# EAGLE design science pcb_urc_v1 (EAGLE 9.6.2)
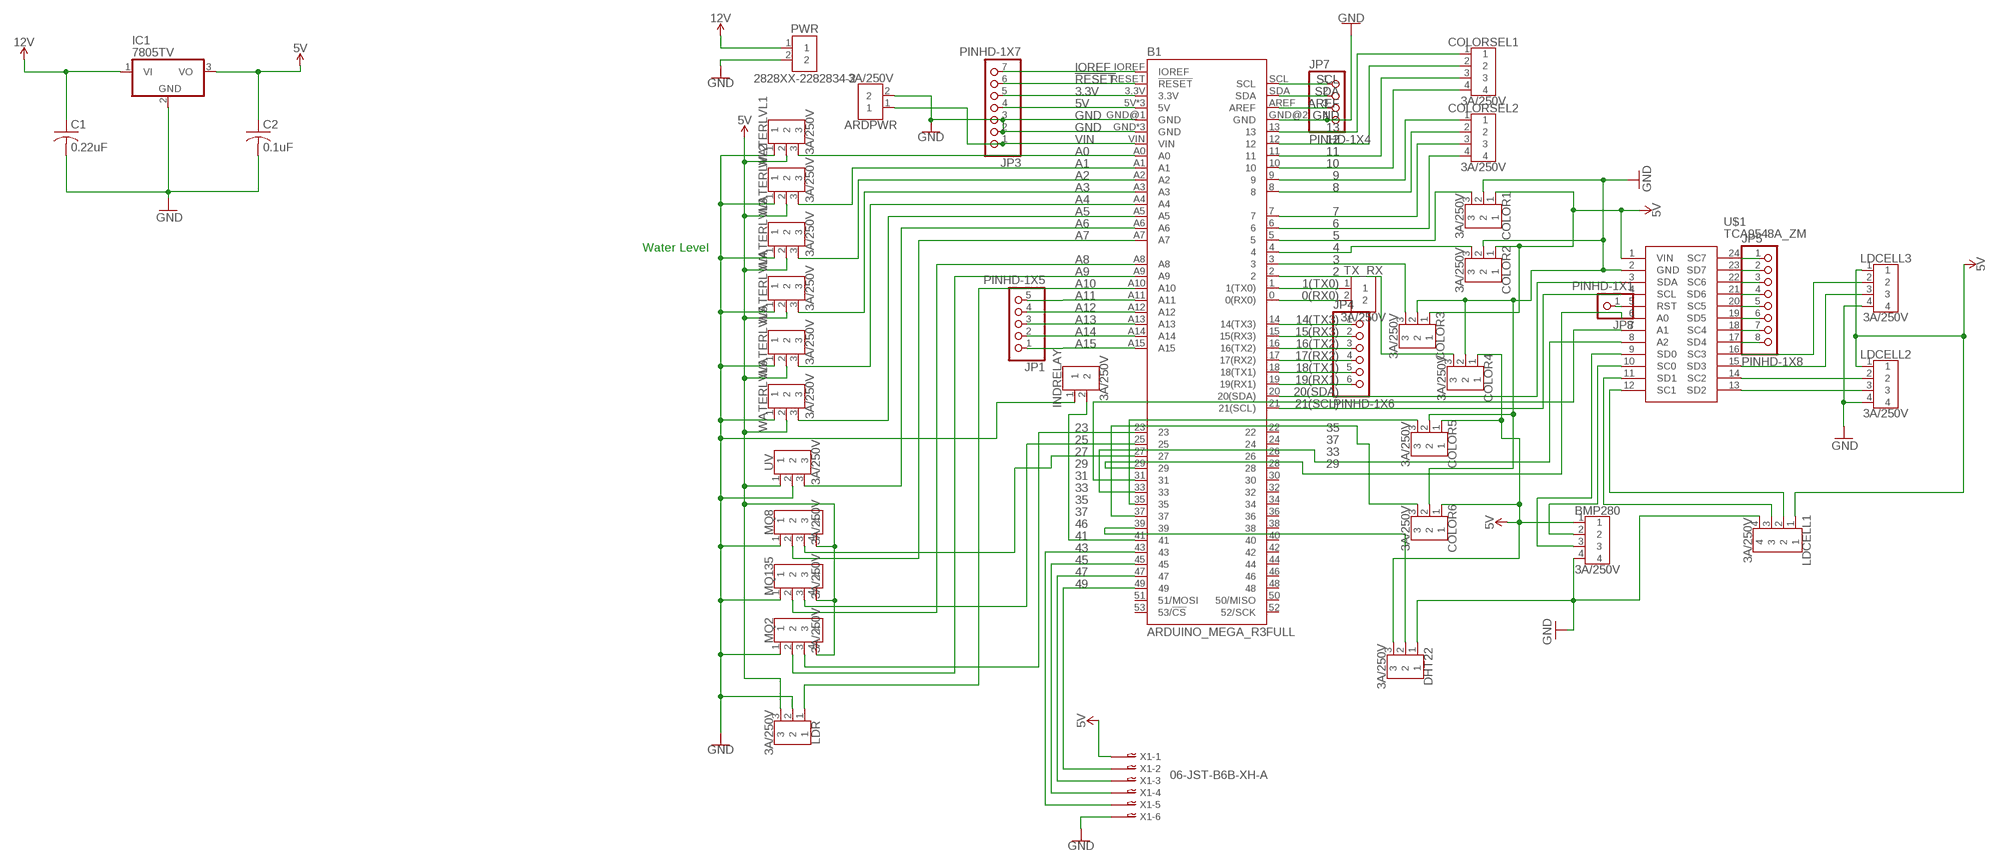
[diagram p0: schematic, sheet 1]

## Parts
ARDPWR  3A/250V  B2B-XH-A  [B2B-XH-A]
B1  ARDUINO_MEGA_R3FULL  [ARDUINO_MEGA_NO_SILK]
BMP280  3A/250V  B4B-XH-A  [B4B-XH-A]
C1  0.22uF  C-US025-025X050  [C025-025X050]
C2  0.1uF  C-US025-025X050  [C025-025X050]
COLOR1  3A/250V  B3B-XH-A  [B3B-XH-A]
COLOR2  3A/250V  B3B-XH-A  [B3B-XH-A]
COLOR3  3A/250V  B3B-XH-A  [B3B-XH-A]
COLOR4  3A/250V  B3B-XH-A  [B3B-XH-A]
COLOR5  3A/250V  B3B-XH-A  [B3B-XH-A]
COLOR6  3A/250V  B3B-XH-A  [B3B-XH-A]
COLORSEL1  3A/250V  B4B-XH-A  [B4B-XH-A]
COLORSEL2  3A/250V  B4B-XH-A  [B4B-XH-A]
DHT22  3A/250V  B3B-XH-A  [B3B-XH-A]
IC1  7805TV  [TO220V]
INDRELAY  3A/250V  B2B-XH-A  [B2B-XH-A]
JP1  PINHD-1X5  [1X05]
JP3  PINHD-1X7  [1X07]
JP4  PINHD-1X6  [1X06]
JP5  PINHD-1X8  [1X08]
JP7  PINHD-1X4  [1X04]
JP8  PINHD-1X1  [1X01]
LDCELL1  3A/250V  B4B-XH-A  [B4B-XH-A]
LDCELL2  3A/250V  B4B-XH-A  [B4B-XH-A]
LDCELL3  3A/250V  B4B-XH-A  [B4B-XH-A]
LDR  3A/250V  B3B-XH-A  [B3B-XH-A]
MQ2  3A/250V  B4B-XH-A  [B4B-XH-A]
MQ8  3A/250V  B4B-XH-A  [B4B-XH-A]
MQ135  3A/250V  B4B-XH-A  [B4B-XH-A]
PWR  2828XX-2282834-2  [TERMBLK_254-2N]
TX_RX  3A/250V  B2B-XH-A  [B2B-XH-A]
U$1  TCA9548A_ZM  [2717]
UV  3A/250V  B3B-XH-A  [B3B-XH-A]
WATERLVL1  3A/250V  B3B-XH-A  [B3B-XH-A]
WATERLVL2  3A/250V  B3B-XH-A  [B3B-XH-A]
WATERLVL3  3A/250V  B3B-XH-A  [B3B-XH-A]
WATERLVL4  3A/250V  B3B-XH-A  [B3B-XH-A]
WATERLVL5  3A/250V  B3B-XH-A  [B3B-XH-A]
WATERLVL6  3A/250V  B3B-XH-A  [B3B-XH-A]
X1  06-JST-B6B-XH-A  [B6B-XH]

## Nets
0(RX0): B1.0(0(RX0)) TX_RX.2
1(TX0): B1.1(1(TX0)) TX_RX.1
2: B1.2 COLOR4.3
3: B1.3 COLOR3.3
3.3V: B1.3.3V JP3.5
4: B1.4 COLOR2.3
5: B1.5 COLOR1.3
5V [PWR]: B1.5V B1.5V@1(5V) B1.5V@2(5V) BMP280.1 C2.1 COLOR1.1 COLOR2.1 COLOR3.1 COLOR4.1 COLOR5.1 COLOR6.1 DHT22.3 IC1.3(VO) JP3.4 LDCELL1.1 LDCELL2.1 LDCELL3.1 LDR.3 MQ2.4 MQ8.4 MQ135.4 U$1.1(VIN) UV.1 WATERLVL1.2 WATERLVL2.2 WATERLVL3.2 WATERLVL4.2 WATERLVL5.2 WATERLVL6.2 X1.P$1
6: B1.6 COLORSEL2.4
7: B1.7 COLORSEL2.3
8: B1.8 COLORSEL2.2
9: B1.9 COLORSEL2.1
10: B1.10 COLORSEL1.4
11: B1.11 COLORSEL1.3
12: B1.12 COLORSEL1.2
12V [PWR]: C1.1 IC1.1(VI) PWR.1
13: B1.13 COLORSEL1.1
14(TX3): B1.14(14(TX3)) JP4.1
15(RX3): B1.15(15(RX3)) JP4.2
16(TX2): B1.16(16(TX2)) JP4.3
17(RX2): B1.17(17(RX2)) JP4.4
18(TX1): B1.18(18(TX1)) JP4.5
19(RX1): B1.19(19(RX1)) JP4.6
20(SDA): B1.20(20(SDA)) U$1.3(SDA)
21(SCL): B1.21(21(SCL)) U$1.4(SCL)
23: B1.27 MQ8.3
25: B1.25 MQ135.3
27: B1.23 MQ2.3
29: B1.29 U$1.6(A0)
31: B1.31 U$1.7(A1)
33: B1.33 U$1.8(A2)
35: B1.35 COLOR5.3
37: B1.37 COLOR6.3
41: B1.41 INDRELAY.2
43: B1.43 X1.P$5
45: B1.45 X1.P$4
46: B1.39 DHT22.2
47: B1.47 X1.P$3
49: B1.49 X1.P$2
!RESET: B1.RESET(!RESET) JP3.6
A0: B1.A0 WATERLVL1.3
A1: B1.A1 WATERLVL2.3
A2: B1.A2 WATERLVL3.3
A3: B1.A3 WATERLVL4.3
A4: B1.A4 WATERLVL5.3
A5: B1.A5 WATERLVL6.3
A6: B1.A6 UV.3
A7: B1.A7 MQ8.2
A8: B1.A8 MQ135.2
A9: B1.A9 MQ2.2
A10: B1.A10 LDR.1
A11: B1.A11 JP1.5
A12: B1.A12 JP1.4
A13: B1.A13 JP1.3
A14: B1.A14 JP1.2
A15: B1.A15 JP1.1
AREF: B1.AREF JP7.3
GND [PWR]: ARDPWR.2 B1.GND B1.GND@1(GND) B1.GND@2(GND) B1.GND@3(GND) B1.GND@4(GND) BMP280.4 C1.2 C2.2 COLOR1.2 COLOR2.2 COLOR3.2 COLOR4.2 COLOR5.2 COLOR6.2 DHT22.1 IC1.2(GND) INDRELAY.1 JP3.2 JP3.3 JP7.4 LDCELL1.4 LDCELL2.4 LDCELL3.4 LDR.2 MQ2.1 MQ8.1 MQ135.1 PWR.2 U$1.2(GND) UV.2 WATERLVL1.1 WATERLVL2.1 WATERLVL3.1 WATERLVL4.1 WATERLVL5.1 WATERLVL6.1 X1.P$6
IOREF: B1.IOREF JP3.7
N$1: LDCELL1.3 U$1.11(SD1)
N$2: LDCELL1.2 U$1.12(SC1)
N$3: LDCELL2.3 U$1.13(SD2)
N$4: LDCELL2.2 U$1.14(SC2)
N$5: LDCELL3.3 U$1.15(SD3)
N$6: LDCELL3.2 U$1.16(SC3)
N$9: JP8.1 U$1.5(RST)
N$10: JP5.1 U$1.24(SC7)
N$11: JP5.2 U$1.23(SD7)
N$12: JP5.3 U$1.22(SC6)
N$13: JP5.4 U$1.21(SD6)
N$14: JP5.5 U$1.20(SC5)
N$15: JP5.6 U$1.19(SD5)
N$16: JP5.7 U$1.18(SC4)
N$17: JP5.8 U$1.17(SD4)
N$32: BMP280.3 U$1.9(SD0)
N$33: BMP280.2 U$1.10(SC0)
SCL: B1.SCL JP7.1
SDA: B1.SDA JP7.2
VIN: ARDPWR.1 B1.VIN JP3.1
Unconnected: B1.22 B1.24 B1.26 B1.28 B1.30 B1.32 B1.34 B1.36 B1.38 B1.40 B1.42 B1.44 B1.46 B1.48 B1.50(50/MISO) B1.51(51/MOSI) B1.52(52/SCK) B1.53(53/!CS)

## Notes on the sheet
- Water Level

## Library data of the parts
ARDPWR INDRELAY TX_RX = Connector:B2B-XH-A: XH Connector Top Entry - 2POS Details see: Datasheet <http://www.jst-mfg.com/product/pdf/eng/eXH.pdf>; CATEGORY: CONNECTOR; DESCRIPTION: 2.5mm pitch/disconnectable crimp style connector; MANUFACTURER: JST (XH CONNECTOR); MPN: B2B-XH-A; OPERATING_TEMPERATURE: -25°C ~ 85°C; PART_STATUS: ACTIVE; ROHS_COMPLIANT: COMPLIANT; SERIES: B_B-XH-A; SUB_CATEGORY: Through hole connector; TYPE: top entry
B1 = SparkFun-Boards:ARDUINO_MEGA_R3: Arduino Mega R3 ATmega2560 R3 compatible footprint. SparkFun Products: Arduino Mega 2560 R3 <https://www.sparkfun.com/products/11061>
BMP280 COLORSEL1 COLORSEL2 LDCELL1-LDCELL3 MQ2 MQ8 MQ135 = Connector:B4B-XH-A: XH Connector Top Entry - 4POS Details see: Datasheet <http://www.jst-mfg.com/product/pdf/eng/eXH.pdf>; CATEGORY: CONNECTOR; DSECRIPTION: 2.5mm pitch/disconnctable crimp style connector; MANUFACTURER: JST (XH connector); MPN: B4B-XH-A; OPERATING_TEMPERATURE: -25 C to 85 C; PART_STATUS: ACTIVE; ROHS_COMPLIANT: COMPLAINT; SERIES: B4B-XH-A; SUB_CATEGORY: Through hole; TYPE: TOP ENTRY
C1 C2 = rcl:C-US: CAPACITOR, American symbol; SPICEPREFIX: C
COLOR1-COLOR6 DHT22 LDR UV WATERLVL1-WATERLVL6 = Connector:B3B-XH-A: XH Connector Top Entry - 3POS Details see: Datasheet <http://www.jst-mfg.com/product/pdf/eng/eXH.pdf>; CATEGORY: CONNECTOR; DESCRIPTION: 2.5mm pitch/disconnectable crimp style connector; MANUFACTURER: JST (XH connector); MPN: B3B-XH-A; PART_STATUS: ACTIVE; ROHS_COMPLIANT: COMPLIANT; SERIES: B3B-XH-A; SUB_CATEGORY: THROUGH HOLE CONNECTOR; TYPE: SIDE ENTRY
IC1 = linear:78*: Positive VOLTAGE REGULATOR Source: http://cache.national.com/ds/LM/LM78L05.pdf http://www.fairchildsemi.com/ds/LM/LM7805.pdf
JP1 = Connector:PINHD-1X5: PIN HEADER; CATEGORY: CONNECTOR; SUB-CATEGORY: PIN-HEADER
JP3 = Connector:PINHD-1X7: PIN HEADER; CATEGORY: CONNECTOR; SUB-CATEGORY: PIN-HEADER
JP4 = Connector:PINHD-1X6: PIN HEADER; CATEGORY: CONNECTOR; SUB-CATEGORY: PIN-HEADER
JP5 = Connector:PINHD-1X8: PIN HEADER; CATEGORY: CONNECTOR; SUB-CATEGORY: PIN-HEADER
JP7 = Connector:PINHD-1X4: PIN HEADER; CATEGORY: CONNECTOR; SUB-CATEGORY: PIN-HEADER
JP8 = Connector:PINHD-1X1: PIN HEADER; CATEGORY: CONNECTOR; SUB-CATEGORY: PIN-HEADER
PWR = Connector:2828XX-2: 2 Position Wire to Board Terminal Block Horizontal with Board Datasheet <https://www.te.com.cn/commerce/DocumentDelivery/DDEController?Action=showdoc&DocId=Catalog+Section%7F1308389_EUROSTYLE_TERMINAL_BLOCKS%7F0607%7Fpdf%7FEnglish%7FENG_CS_1308389_EUROSTYLE_TERMINAL_BLOCKS_0607.pdf%7F2-282837-5>
U$1 = TCA9548A_ZM:TCA9548A_ZM
X1 = bt_con-jst-xh:06-JST: JST CONNECTOR

## Net classes
0 default: width 0.762 mm
1 PWR: width 1.27 mm

## Board
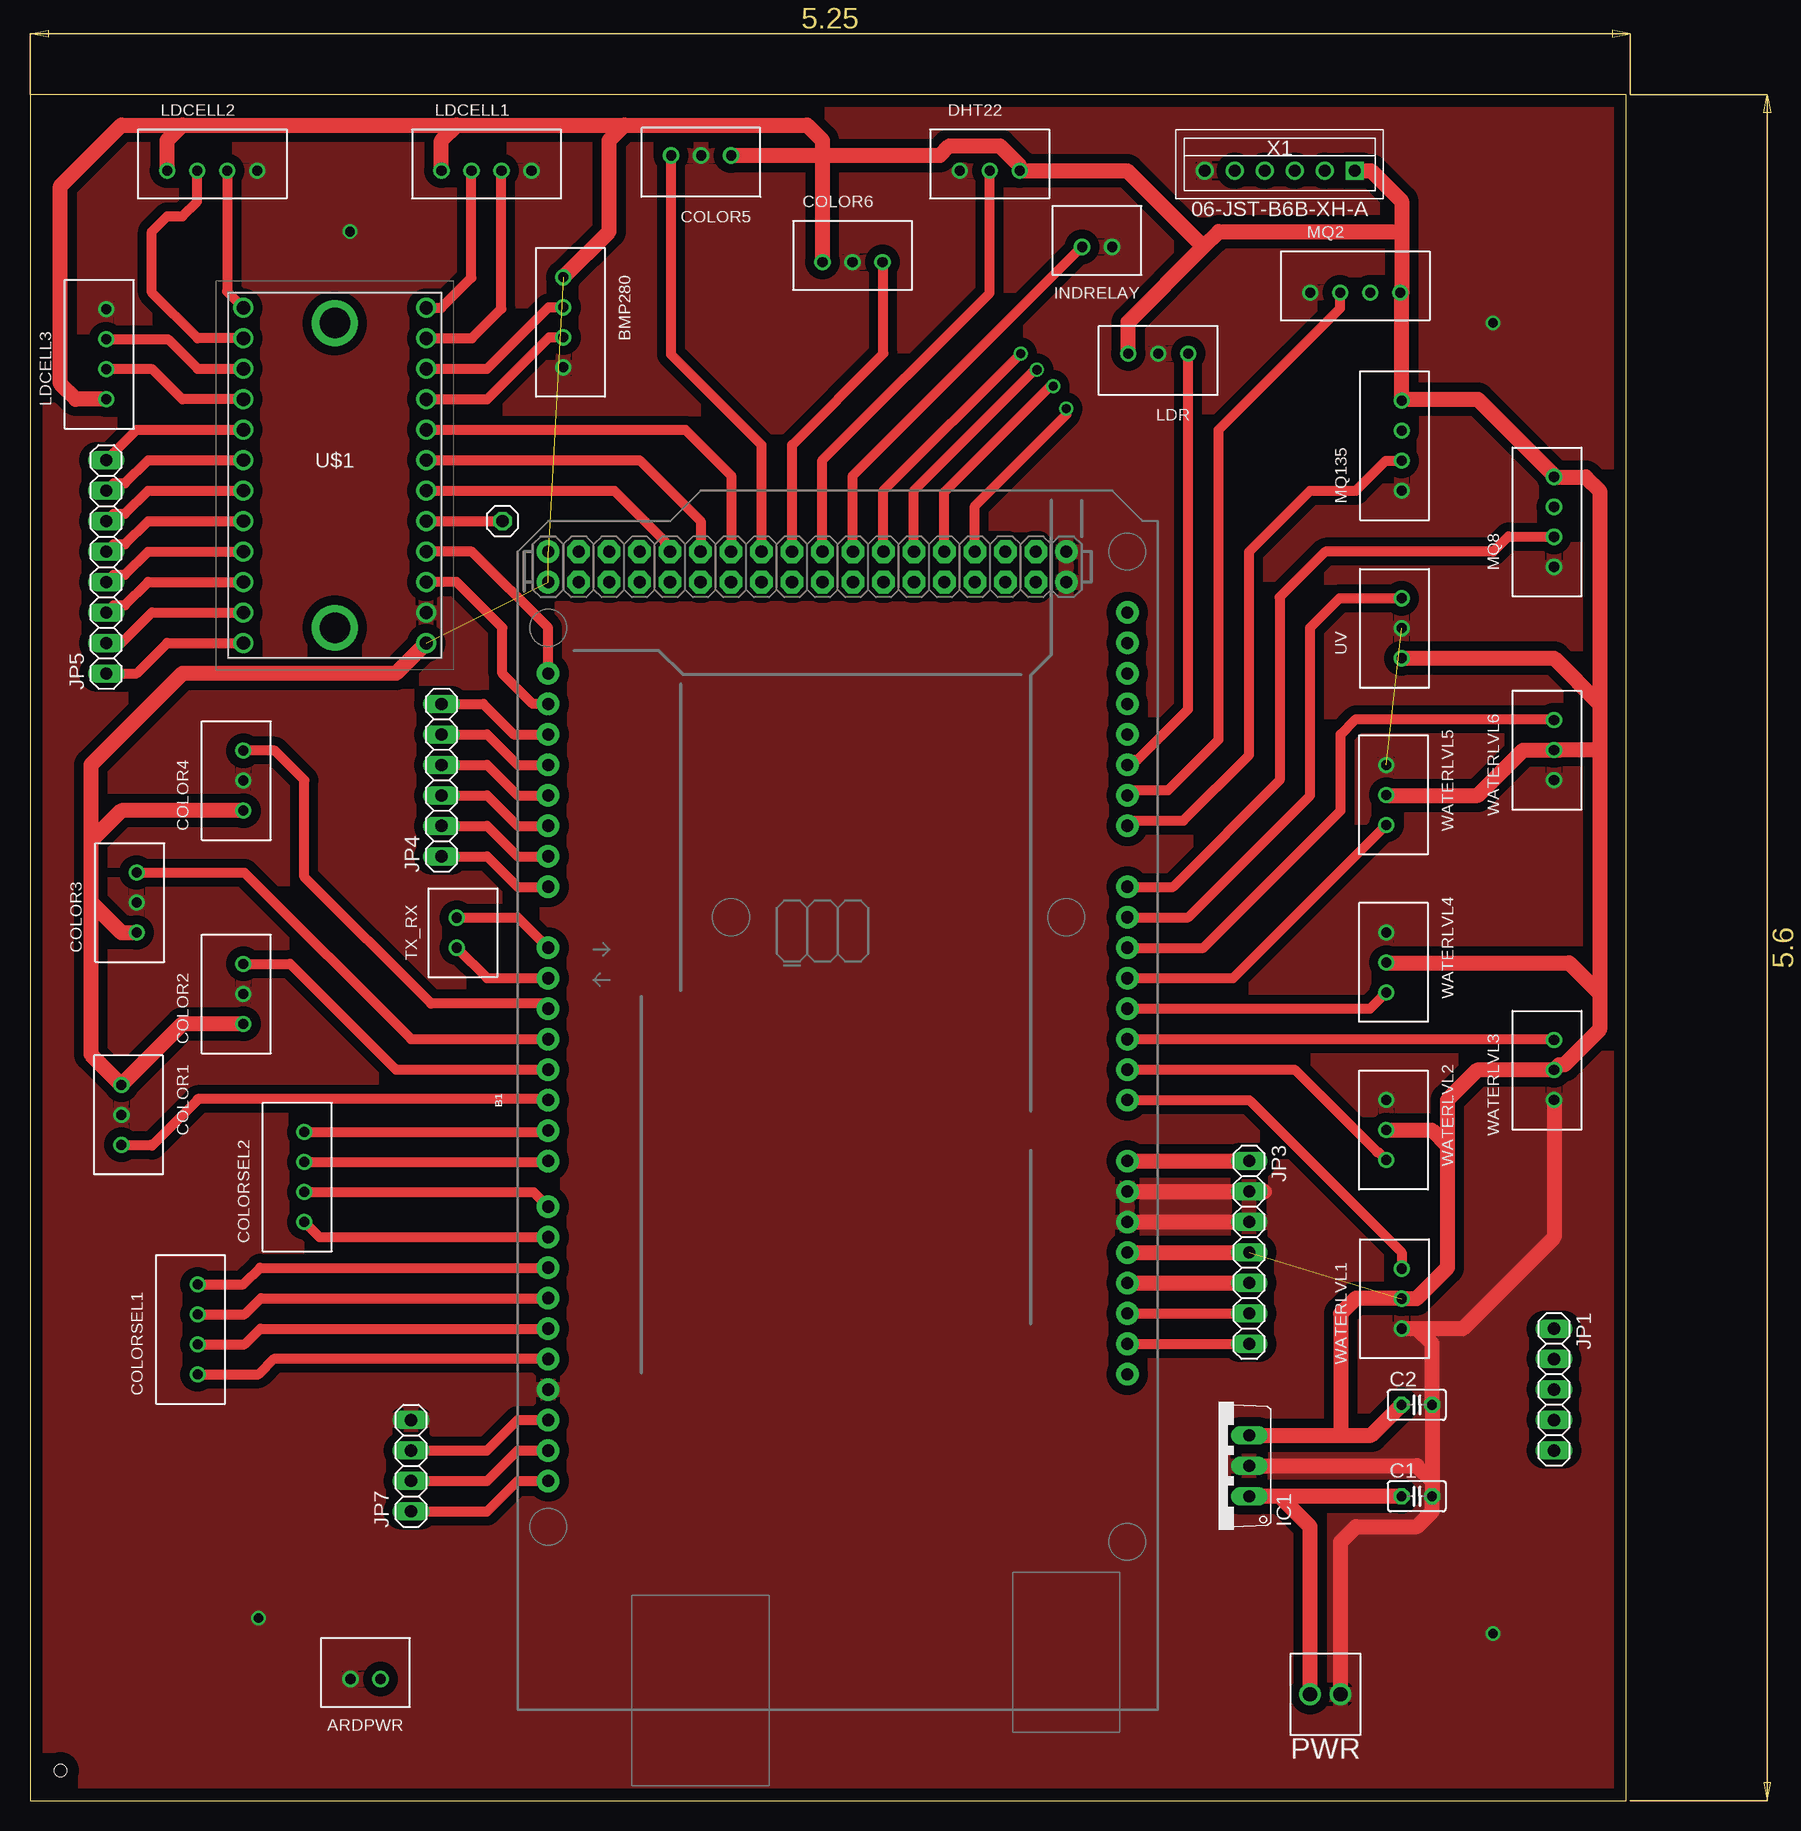
[diagram p1: board, top side]
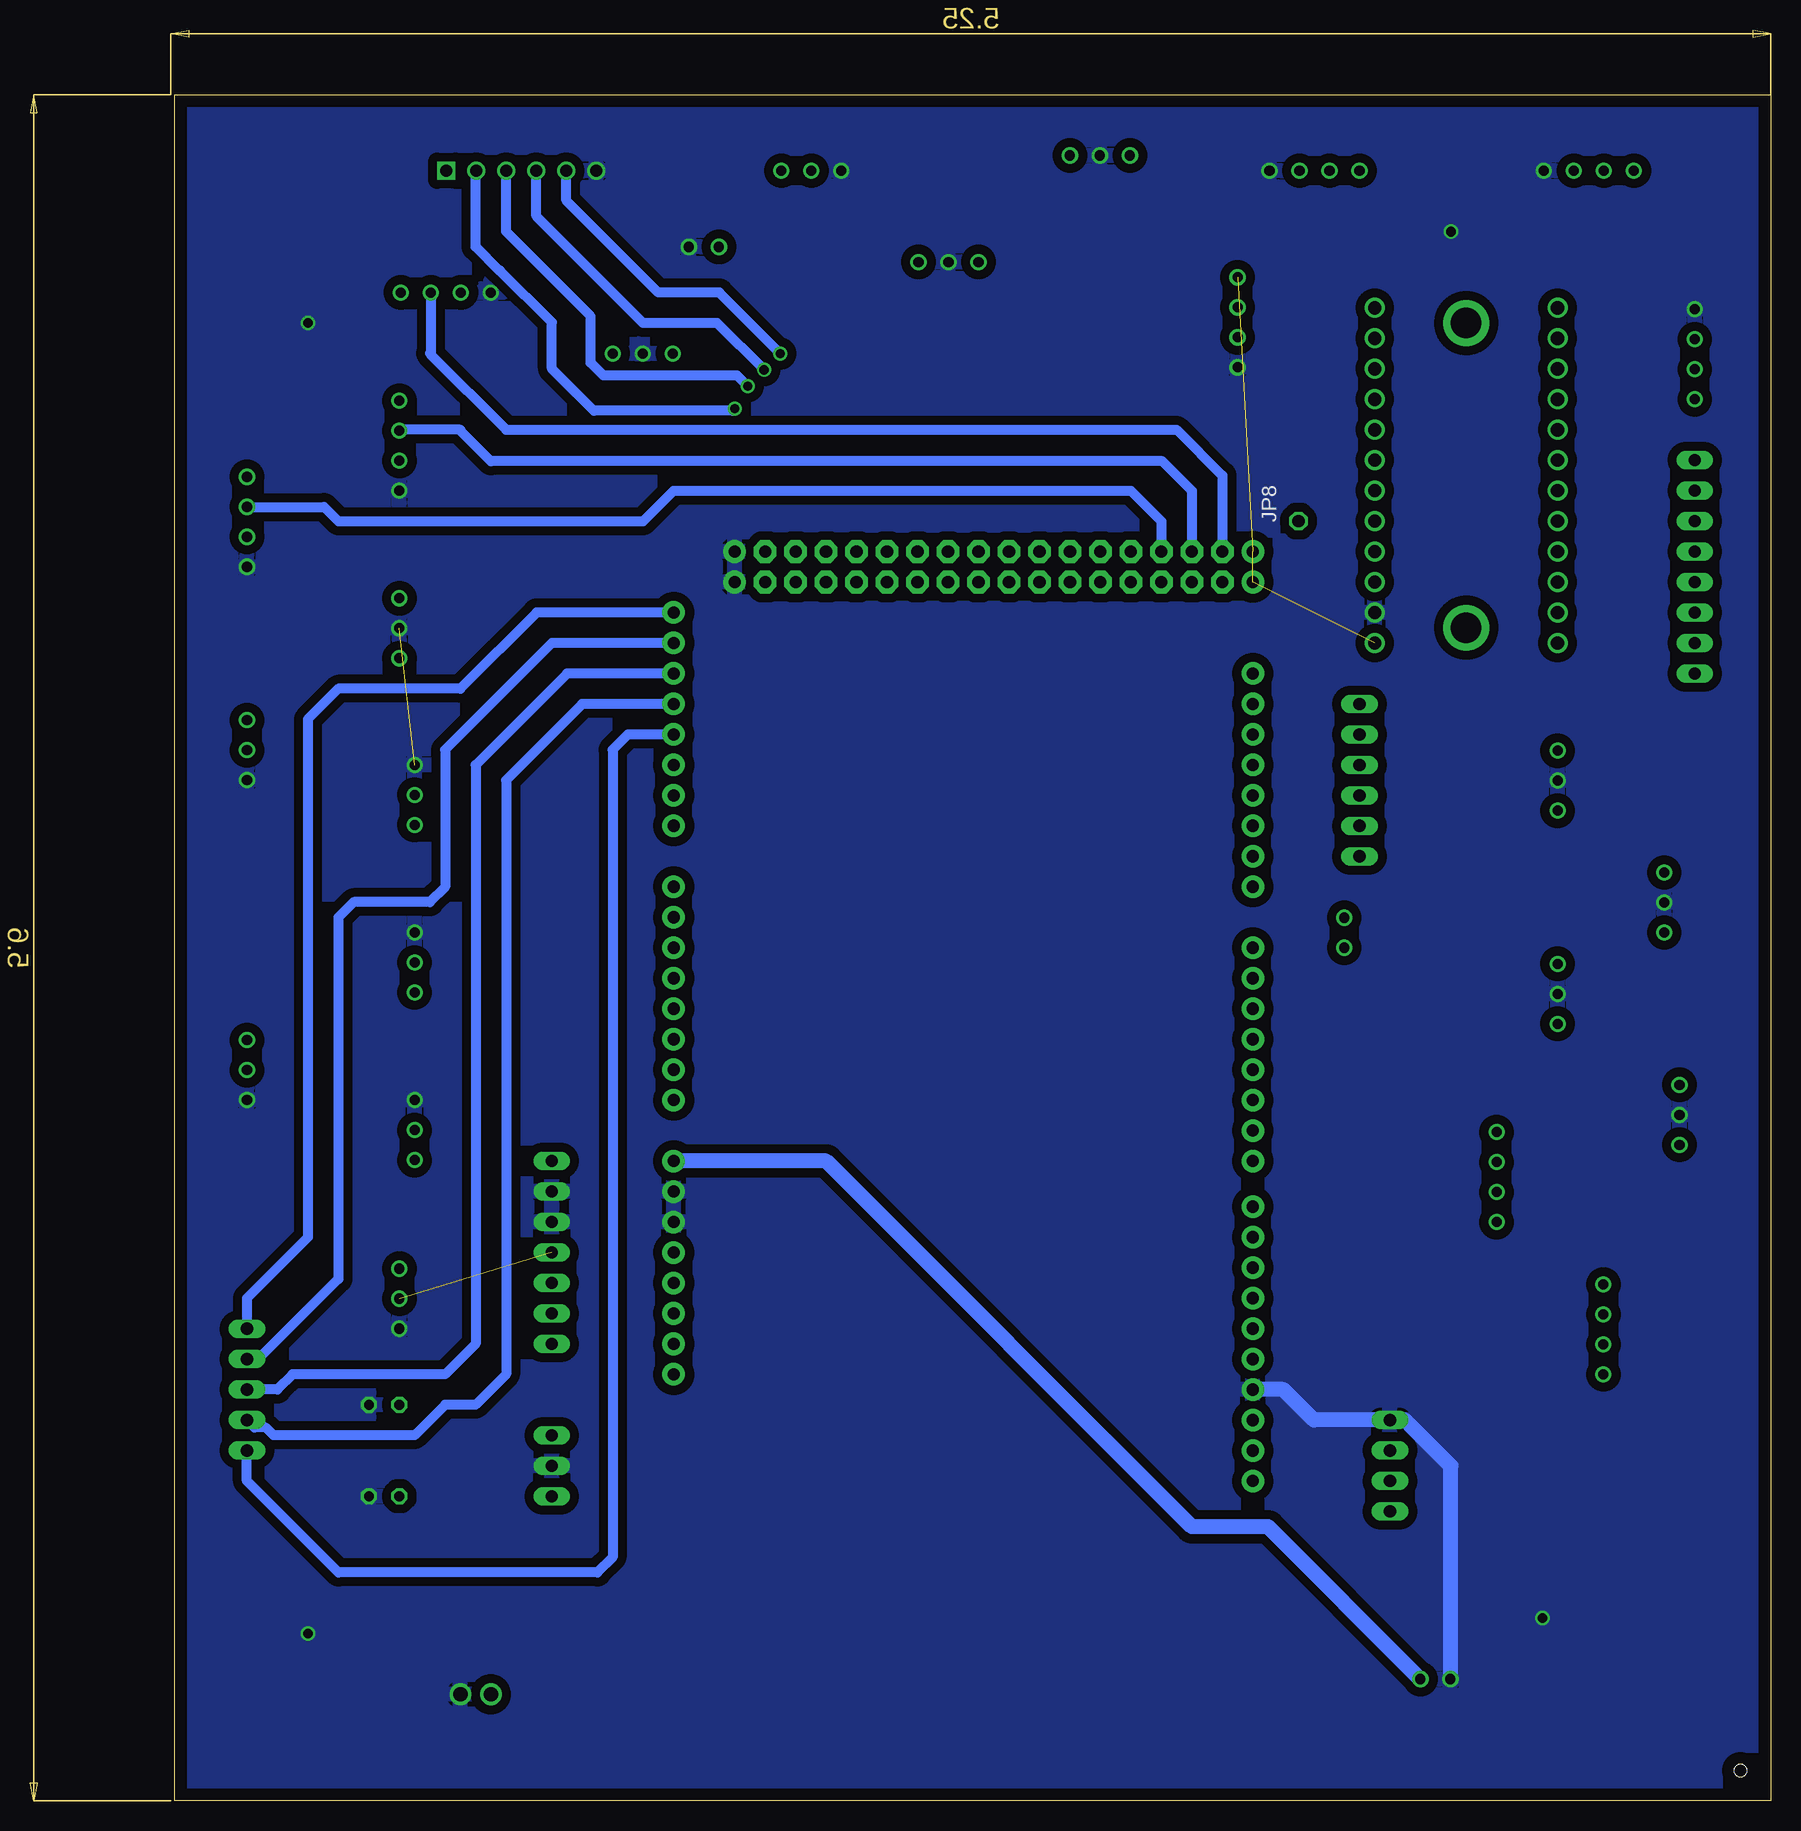
[diagram p2: board, bottom side, seen from below]

Size 133.01 x 142.23 mm. Coordinates in mm from the lower left corner, seen from the top.
Outline: 0,142.23 0,0 133.01,0 133.01,142.23 0,142.23
Copper layers (1*16): Top 0.035mm / dielectric 1.5mm / Bottom 0.035mm
Design rules "techshopbd *": minimum track width 0.76mm, minimum drill 0.76mm, track to track 0.76mm, track to pad 0.76mm, pad to pad 0.76mm, via to via 0.76mm, smd to smd 0.76mm, copper to edge 40mil, drill to drill 6mil, minimum pad ring 10mil, minimum via ring 8mil, stop-mask expansion 4mil, vias tented up to drill 0mil, thermal gap 10mil
Holes 1 mm at 2.54,2.54

### Footprints (pad centres in the part's own frame; a part is rotated, then mirrored left to right if it is on the bottom)
B2B-XH-A = drill 0.84: 1 0,0; 2 2.5,0
ARDUINO_MEGA_NO_SILK = drill 1.016 pad 1.88: 0 13.97,24.13; 1 11.43,24.13; 2 8.89,24.13; 3 6.35,24.13; 3.3V -13.97,-24.13; 4 3.81,24.13; 5 1.27,24.13; 5V -11.43,-24.13; 5V@1 44.45,24.13; 5V@2 46.99,24.13; 6 -1.27,24.13; 7 -3.81,24.13; 8 -7.62,24.13; 9 -10.16,24.13; 10 -12.7,24.13; 11 -15.24,24.13; 12 -17.78,24.13; 13 -20.32,24.13; 14 19.05,24.13; 15 21.59,24.13; 16 24.13,24.13; 17 26.67,24.13; 18 29.21,24.13; 19 31.75,24.13; 20 34.29,24.13; 21 36.83,24.13; A0 1.27,-24.13; A1 3.81,-24.13; A2 6.35,-24.13; A3 8.89,-24.13; A4 11.43,-24.13; A5 13.97,-24.13; A6 16.51,-24.13; A7 19.05,-24.13; A8 24.13,-24.13; A9 26.67,-24.13; A10 29.21,-24.13; A11 31.75,-24.13; A12 34.29,-24.13; A13 36.83,-24.13; A14 39.37,-24.13; A15 41.91,-24.13; AREF -25.4,24.13; GND -8.89,-24.13; GND@1 -6.35,-24.13; GND@2 44.45,-19.05; GND@3 46.99,-19.05; GND@4 -22.86,24.13; IOREF -19.05,-24.13; NC -21.59,-24.13; RESET -16.51,-24.13; SCL -30.48,24.13; SDA -27.94,24.13; VIN -3.81,-24.13 | drill 1.016 pad 1.88 octagon: 22 44.45,21.59; 23 46.99,21.59; 24 44.45,19.05; 25 46.99,19.05; 26 44.45,16.51; 27 46.99,16.51; 28 44.45,13.97; 29 46.99,13.97; 30 44.45,11.43; 31 46.99,11.43; 32 44.45,8.89; 33 46.99,8.89; 34 44.45,6.35; 35 46.99,6.35; 36 44.45,3.81; 37 46.99,3.81; 38 44.45,1.27; 39 46.99,1.27; 40 44.45,-1.27; 41 46.99,-1.27; 42 44.45,-3.81; 43 46.99,-3.81; 44 44.45,-6.35; 45 46.99,-6.35; 46 44.45,-8.89; 47 46.99,-8.89; 48 44.45,-11.43; 49 46.99,-11.43; 50 44.45,-13.97; 51 46.99,-13.97; 52 44.45,-16.51; 53 46.99,-16.51
B4B-XH-A = drill 0.84: 1 0,0; 2 2.5,0; 3 5,0; 4 7.5,0
C025-025X050 = drill 0.813 octagon: 1 -1.27,0; 2 1.27,0
B3B-XH-A = drill 0.84: 1 0,0; 2 2.5,0; 3 5,0
TO220V = drill 1.016 long: 1 -2.54,-2.54; 2 0,-2.54; 3 2.54,-2.54
1X05 = drill 1.016 long: 1 -5.08,0; 2 -2.54,0; 3 0,0; 4 2.54,0; 5 5.08,0
1X07 = drill 1.016 long: 1 -7.62,0; 2 -5.08,0; 3 -2.54,0; 4 0,0; 5 2.54,0; 6 5.08,0; 7 7.62,0
1X06 = drill 1.016 long: 1 -6.35,0; 2 -3.81,0; 3 -1.27,0; 4 1.27,0; 5 3.81,0; 6 6.35,0
1X08 = drill 1.016 long: 1 -8.89,0; 2 -6.35,0; 3 -3.81,0; 4 -1.27,0; 5 1.27,0; 6 3.81,0; 7 6.35,0; 8 8.89,0
1X04 = drill 1.016 long: 1 -3.81,0; 2 -1.27,0; 3 1.27,0; 4 3.81,0
1X01 = drill 1.016 octagon: 1 0,0
TERMBLK_254-2N = drill 1.2: 1 0,0; 2 2.54,0
2717 = drill 1.11 pad 1.665: 1 -7.62,13.97; 2 -7.62,11.43; 3 -7.62,8.89; 4 -7.62,6.35; 5 -7.62,3.81; 6 -7.62,1.27; 7 -7.62,-1.27; 8 -7.62,-3.81; 9 -7.62,-6.35; 10 -7.62,-8.89; 11 -7.62,-11.43; 12 -7.62,-13.97; 13 7.62,-13.97; 14 7.62,-11.43; 15 7.62,-8.89; 16 7.62,-6.35; 17 7.62,-3.81; 18 7.62,-1.27; 19 7.62,1.27; 20 7.62,3.81; 21 7.62,6.35; 22 7.62,8.89; 23 7.62,11.43; 24 7.62,13.97 | drill 2.54 pad 3.81: 25 0,12.7; 26 0,-12.7
B6B-XH = drill 1 square: P$1 6.25,0 | drill 1: P$2 3.75,0; P$3 1.25,0; P$4 -1.25,0; P$5 -3.75,0; P$6 -6.25,0

### Placement (x,y rotation side)
ARDPWR  29.21,10.16 180 top
B1  67.31,57.15 90 top
BMP280  44.45,127 270 top
C1  115.57,25.4 0 top
C2  115.57,33.02 0 top
COLOR1  7.62,59.69 270 top
COLOR2  17.78,64.77 90 top
COLOR3  8.89,72.39 90 top
COLOR4  17.78,82.55 90 top
COLOR5  58.42,137.16 180 top
COLOR6  66.04,128.27 0 top
COLORSEL1  13.97,35.56 90 top
COLORSEL2  22.86,48.26 90 top
DHT22  77.47,135.89 0 top
IC1  99.06,27.94 90 top
INDRELAY  90.17,129.54 180 top
JP1  127,34.29 270 top
JP3  101.6,45.72 270 top
JP4  34.29,85.09 90 top
JP5  6.35,102.87 90 top
JP7  31.75,27.94 90 top
JP8  39.37,106.68 270 top
LDCELL1  34.29,135.89 0 top
LDCELL2  11.43,135.89 0 top
LDCELL3  6.35,116.84 90 top
LDR  96.52,120.65 180 top
MQ2  106.68,125.73 0 top
MQ8  127,102.87 90 top
MQ135  114.3,109.22 90 top
PWR  106.68,8.89 0 top
TX_RX  35.56,71.12 90 top
U$1  25.4,110.49 180 top
UV  114.3,95.25 90 top
WATERLVL1  114.3,39.37 90 top
WATERLVL2  113.03,58.42 270 top
WATERLVL3  127,58.42 90 top
WATERLVL4  113.03,72.39 270 top
WATERLVL5  113.03,86.36 270 top
WATERLVL6  127,85.09 90 top
X1  104.14,135.89 0 top

### Tracks (layer width: path | path; a pad name or v marks a point on that pad's centre or on a via)
0(RX0)
  Top 0.813: TX_RX.2 35.6,73.66 40.64,73.66 B1.0
1(TX0)
  Top 0.813: TX_RX.1 38.1,68.58 B1.1
2
  Top 0.813: B1.2 42.75,66.47 33.42,66.47 22.86,77.03 22.86,85.09 20.4,87.55 COLOR4.3
3
  Top 0.813: COLOR3.3 17.86,77.39 31.75,63.5 B1.3
3.3V
  Top 1.27: B1.3.3V JP3.5
4
  Top 0.813: COLOR2.3 21.67,69.77 30.48,60.96 B1.4
5
  Top 0.813: B1.5 43.1,58.5 13.97,58.5 13.97,58.42 10.16,54.61 10.08,54.69 COLOR1.3
5V  (4 unrouted)
  Top 1.27: B1.5V JP3.4 | IC1.3 109.22,30.48 | 109.22,30.48 111.76,30.48 C2.1 | 109.22,30.48 109.22,40.64 110.49,41.91 114.26,41.91 WATERLVL1.2 115.53,41.87 118.11,44.45 118.11,54.61 | WATERLVL2.2 116.8,55.92 118.11,54.61 | 118.11,54.61 118.11,58.42 120.61,60.92 WATERLVL3.2 127.43,61.35 127.86,61.35 130.81,64.3 130.81,67.31 | WATERLVL4.2 113.07,69.85 128.27,69.85 130.81,67.31 | WATERLVL5.2 113.07,83.82 120.65,83.82 124.42,87.59 WATERLVL6.2 | WATERLVL6.2 127.43,87.59 | 130.81,87.63 130.81,67.31 | UV.1 127,95.25 130.81,91.44 | 130.81,91.44 130.81,87.63 | WATERLVL6.2 127.04,87.63 130.81,87.63 | 130.81,91.44 130.81,109.22 129.66,110.37 MQ8.4 127,110.49 120.65,116.84 114.42,116.84 MQ135.4 114.3,125.61 | 114.3,125.61 MQ2.4 | X1.P$1 111.76,135.89 114.3,133.35 114.3,130.81 | 114.3,130.81 114.3,125.61 | LDR.3 91.52,123.27 97.79,129.54 | 114.3,130.81 99.06,130.81 97.79,129.54 | 97.79,129.54 91.44,135.89 DHT22.3 | DHT22.3 82.55,135.97 | 66.04,137.16 75.81,137.16 76.61,137.96 80.83,137.96 82.47,136.32 DHT22.3 | 66.04,137.16 COLOR5.1 | 49.53,139.7 48.26,138.43 48.26,130.81 BMP280.1 | 49.53,139.7 64.77,139.7 66.04,138.43 66.04,137.16 | 66.04,137.16 COLOR6.1 | LDCELL1.1 34.29,138.43 35.56,139.7 | 35.56,139.7 49.53,139.7 | LDCELL2.1 11.43,138.43 12.7,139.7 | 12.7,139.7 35.56,139.7 | LDCELL3.1 3.81,116.84 2.54,118.11 2.54,134.62 7.62,139.7 12.7,139.7 | COLOR2.1 12.7,64.77 COLOR1.1 5.08,62.23 5.08,74.93 | 5.08,80.01 5.08,74.93 | 5.08,74.93 7.62,72.39 COLOR3.1 | COLOR4.1 7.62,82.55 5.08,80.01 | 5.08,80.01 5.08,86.36 12.7,93.98 30.48,93.98 U$1.1
6
  Top 0.813: COLORSEL2.4 43.06,55.76 B1.6
7
  Top 0.813: COLORSEL2.3 43.1,53.26 B1.7
8
  Top 0.813: COLORSEL2.2 41.95,50.76 B1.8
9
  Top 0.813: B1.9 24.13,46.99 COLORSEL2.1
10
  Top 0.813: COLORSEL1.4 17.78,43.06 19.17,44.45 B1.10
11
  Top 0.813: COLORSEL1.3 17.88,40.56 19.23,41.91 B1.11
12
  Top 0.813: COLORSEL1.2 17.88,38.06 19.19,39.37 B1.12
12V
  Top 1.27: PWR.1 106.68,22.86 104.14,25.4 | 104.14,25.4 IC1.1 | C1.1 104.14,25.4
13
  Top 0.813: B1.13 20.32,36.83 19.05,35.56 COLORSEL1.1
14(TX3)
  Top 0.813: JP4.1 38.1,78.74 40.64,76.2 B1.14
15(RX3)
  Top 0.813: JP4.2 38.1,81.28 40.64,78.74 B1.15
16(TX2)
  Top 0.813: JP4.3 38.1,83.82 40.64,81.28 B1.16
17(RX2)
  Top 0.813: JP4.4 38.1,86.36 40.64,83.82 B1.17
18(TX1)
  Top 0.813: JP4.5 38.1,88.9 40.64,86.36 B1.18
19(RX1)
  Top 0.813: B1.19 40.32,88.9 37.78,91.44 JP4.6
20(SDA)
  Top 0.813: B1.20 41.91,91.44 39.37,93.98 39.37,97.79 35.56,101.6 U$1.3
21(SCL)
  Top 0.813: B1.21 43.18,97.79 36.83,104.14 U$1.4
23
  Bottom 0.813: MQ8.3 120.57,107.87 119.38,106.68 93.98,106.68 91.44,109.22 53.34,109.22 50.8,106.68 B1.27
25
  Bottom 0.813: B1.25 48.26,109.22 50.72,111.68 106.68,111.68 109.22,114.22 109.22,114.3 114.22,114.3 MQ135.3
27
  Bottom 0.813: MQ2.3 111.68,120.73 111.76,120.65 105.41,114.3 49.53,114.3 45.72,110.49 B1.23
29
  Top 0.813: B1.29 52.91,104.57 52.91,105.01 48.7,109.22 U$1.6
31
  Top 0.813: U$1.7 50.8,111.76 55.88,106.68 B1.31
33
  Top 0.813: U$1.8 54.61,114.3 58.42,110.49 B1.33
35
  Top 0.813: COLOR5.3 53.42,120.57 60.96,113.03 B1.35
37
  Top 0.813: COLOR6.3 71.12,128.19 71.12,120.65 63.5,113.03 B1.37
41
  Top 0.813: B1.41 68.58,110.49 87.63,129.54 INDRELAY.2
43  (via drill 0.76)
  Top 0.813: B1.43 71.12,109.22 v82.55,120.65
  Bottom 0.813: v82.55,120.65 87.63,125.73 92.71,125.73 100.39,133.41 X1.P$5
45  (via drill 0.76)
  Top 0.813: v83.91,119.29 83.82,119.38 73.66,109.22 B1.45
  Bottom 0.813: v83.91,119.29 87.81,123.19 93.98,123.19 102.89,132.1 X1.P$4
46
  Top 0.813: B1.39 66.04,111.76 79.97,125.69 DHT22.2
47  (via drill 0.76)
  Top 0.813: v85.27,117.93 85.15,118.05 76.2,109.1 B1.47
  Bottom 0.813: v85.27,117.93 86.16,118.81 97.28,118.81 98.36,119.89 98.36,123.76 105.41,130.81 105.41,135.87 X1.P$3
49  (via drill 0.75)
  Top 0.813: B1.49 78.74,107.95 86.36,115.57 v86.36,116.05
  Bottom 0.813: v86.36,116.05 86.54,115.87 98.09,115.87 101.6,119.38 101.6,123.25 105.92,127.57 105.98,127.57 107.95,129.54 107.95,135.83 X1.P$2
!RESET
  Top 0.813: B1.RESET JP3.6
A0
  Top 0.813: B1.A0 101.6,58.42 114.3,45.72 WATERLVL1.3
A1
  Top 0.813: WATERLVL2.3 112.37,54.08 112.27,54.08 105.39,60.96 B1.A1
A2
  Top 0.813: B1.A2 126.92,63.5 WATERLVL3.3
A3
  Top 0.813: B1.A3 111.68,66.04 WATERLVL4.3
A4
  Top 0.813: B1.A4 100.25,68.58 WATERLVL5.3
A5
  Top 0.813: B1.A5 97.79,71.12 109.22,82.55 109.22,88.9 110.49,90.17 126.92,90.17 WATERLVL6.3
A6
  Top 0.813: B1.A6 96.52,73.66 106.68,83.82 106.68,97.79 109.14,100.25 UV.3
A7
  Top 0.813: B1.A7 95.25,76.2 104.14,85.09 104.14,100.33 107.95,104.14 121.92,104.14 123.19,105.41 123.23,105.37 MQ8.2
A8
  Top 0.813: B1.A8 91.87,81.71 96.12,81.71 101.6,87.19 101.6,104.14 106.68,109.22 110.49,109.22 112.99,111.72 MQ135.2
A9
  Top 0.813: B1.A9 91.87,84.25 94.85,84.25 99.06,88.46 99.06,114.3 109.18,124.42 MQ2.2
A10
  Top 0.813: B1.A10 91.87,86.79 92.31,86.79 96.52,91 LDR.1
A11
  Bottom 0.813: B1.A11 95.25,88.9 96.52,87.63 96.52,20.32 97.79,19.05 119.38,19.05 127,26.67 JP1.5
A12
  Bottom 0.813: B1.A12 99.06,91.44 105.41,85.09 105.41,35.56 107.95,33.02 110.49,33.02 113.03,30.48 124.78,30.48 125.44,31.14 126.39,31.14 JP1.4
A13
  Bottom 0.813: B1.A13 100.33,93.98 107.95,86.36 107.95,38.1 110.49,35.56 123.19,35.56 124.46,34.29 JP1.3
A14
  Bottom 0.813: B1.A14 101.6,96.52 110.49,87.63 110.49,76.2 111.76,74.93 118.11,74.93 119.38,73.66 119.38,43.5 126.05,36.83 JP1.2
A15
  Bottom 0.813: B1.A15 102.87,99.06 109.22,92.71 119.38,92.71 121.92,90.17 121.92,46.99 127,41.91 JP1.1
AREF
  Top 0.813: JP7.3 38.1,29.21 40.64,31.75 B1.AREF
GND  (via drill 0.8)  (1 unrouted)
  Top 1.27: B1.GND JP3.3 | B1.GND@1 102.87,50.8 | PWR.2 109.22,21.59 110.49,22.86 115.57,22.86 116.84,24.13 C1.2 116.84,26.67 | IC1.2 115.57,27.94 116.84,26.67 | 116.84,26.67 C2.2 116.84,38.1 115.57,39.37 WATERLVL1.1 119.38,39.37 127,46.99 WATERLVL3.1
  Bottom 1.27: ARDPWR.2 26.67,10.28 26.67,27.94 30.09,31.37 30.1,31.37 30.48,31.75 | 30.48,31.75 | 30.48,31.75 JP7.4 38.1,31.75 40.64,34.29 B1.GND@4
  other vias: 26.67,130.81 121.92,123.19 121.92,13.97 19.05,15.24
  pour Top: 0,142.24 133.35,142.24 133.35,0 0,0
  pour Bottom: 0,142.24 133.35,142.24 133.35,0 0,0
IOREF
  Top 0.813: B1.IOREF JP3.7
N$1
  Top 0.813: U$1.11 36.83,121.92 39.29,124.38 LDCELL1.3
N$2
  Top 0.813: U$1.12 34.29,124.46 36.79,126.96 LDCELL1.2
N$3
  Top 0.813: LDCELL2.3 16.43,125.81 U$1.13
N$4
  Top 0.813: U$1.14 13.97,121.92 10.16,125.73 10.16,130.81 11.43,132.08 12.7,132.08 13.93,133.31 LDCELL2.2
N$5
  Top 0.813: LDCELL3.3 11.51,121.84 13.97,119.38 U$1.15
N$6
  Top 0.813: U$1.16 12.7,116.84 10.2,119.34 LDCELL3.2
N$9
  Top 0.813: U$1.5 JP8.1
N$10
  Top 0.813: U$1.24 11.43,96.52 8.89,93.98 JP5.1
N$11
  Top 0.813: JP5.2 7.62,96.52 10.16,99.06 U$1.23
N$12
  Top 0.813: JP5.3 6.96,99.67 7.91,99.67 9.84,101.6 U$1.22
N$13
  Top 0.813: JP5.4 6.96,102.21 7.91,102.21 9.84,104.14 U$1.21
N$14
  Top 0.813: JP5.5 6.96,104.75 7.91,104.75 9.84,106.68 U$1.20
N$15
  Top 0.813: JP5.6 6.96,107.29 7.91,107.29 9.84,109.22 U$1.19
N$16
  Top 0.813: JP5.7 6.96,109.83 7.91,109.83 9.84,111.76 U$1.18
N$17
  Top 0.813: JP5.8 8.89,114.3 U$1.17
N$32
  Top 0.813: U$1.9 38.1,116.84 43.26,122 BMP280.3
N$33
  Top 0.813: BMP280.2 43.22,124.5 38.1,119.38 U$1.10
SCL
  Top 0.813: JP7.1 38.1,24.13 40.64,26.67 B1.SCL
SDA
  Top 0.813: JP7.2 38.1,26.67 40.64,29.21 B1.SDA
VIN
  Top 1.27: B1.VIN JP3.1
  Bottom 1.27: B1.VIN 78.74,53.34 48.26,22.86 41.91,22.86 ARDPWR.1